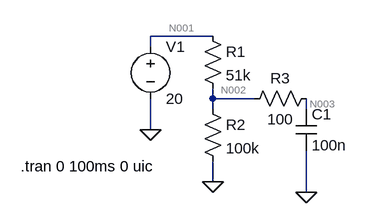
[diagram p0: schematic P-MOS-Charge.asc]
P-MOS-Charge.asc, the LTspice schematic file:
Version 4
SHEET 1 880 680
WIRE 128 128 32 128
WIRE 32 144 32 128
WIRE 128 224 128 208
WIRE 192 224 128 224
WIRE 128 240 128 224
WIRE 272 240 272 224
WIRE 32 272 32 224
WIRE 128 352 128 320
WIRE 272 368 272 304
FLAG 32 272 0
FLAG 272 368 0
FLAG 128 352 0
SYMBOL voltage 32 128 R0
SYMATTR InstName V1
SYMATTR Value 20
SYMBOL cap 256 240 R0
SYMATTR InstName C1
SYMATTR Value 100n
SYMBOL res 112 112 R0
SYMATTR InstName R1
SYMATTR Value 51k
SYMBOL res 112 224 R0
SYMATTR InstName R2
SYMATTR Value 100k
SYMBOL res 288 208 R90
WINDOW 0 0 56 VBottom 2
WINDOW 3 32 56 VTop 2
SYMATTR InstName R3
SYMATTR Value 100
TEXT -168 328 Left 2 !.tran 0 100ms 0 uic

The netlist it stands for:
* P-MOS-Charge.asc
V1 N001 0 20
C1 N003 0 100n
R1 N001 N002 51k
R2 N002 0 100k
R3 N003 N002 100
.tran 0 100ms 0 uic
.backanno
.end

* Results of the author's LTspice run, read from the files saved beside the schematic
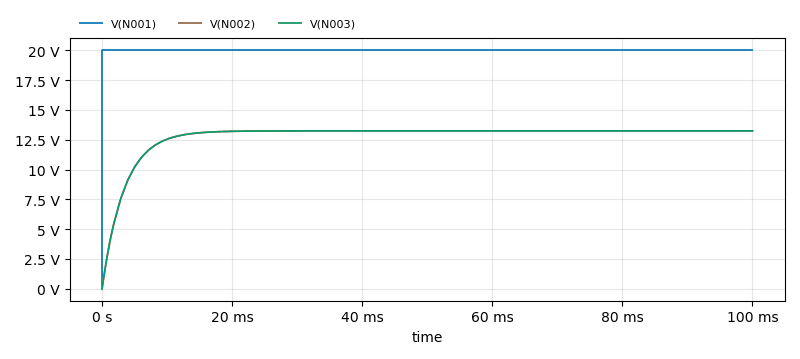
[diagram p1: Transient Analysis of P-MOS-Charge.asc, plotted from the saved traces]
* Transient Analysis, 1 run:
*   V(N001): min 0 V, max 20 V, average 20 V, rms 20 V, last 20 V
*   V(N002): min 0 V, max 13.25 V, average 12.8 V, rms 12.9 V, last 13.25 V
*   V(N003): min 0 V, max 13.25 V, average 12.79 V, rms 12.9 V, last 13.25 V